# Altium schematic sheet Cart.SchDoc: Cart
size Tabloid; ApprovedBy: NA; CompanyName: Cospan Design LLC; DrawnBy: David McCoy; Engineer: David McCoy; DocumentNumber: 12; Revision: A; SheetNumber: 12; SheetTotal: 18; Client: OSH; Project: Guppy Buddy; ProjectPrettyName: Guppy Buddy
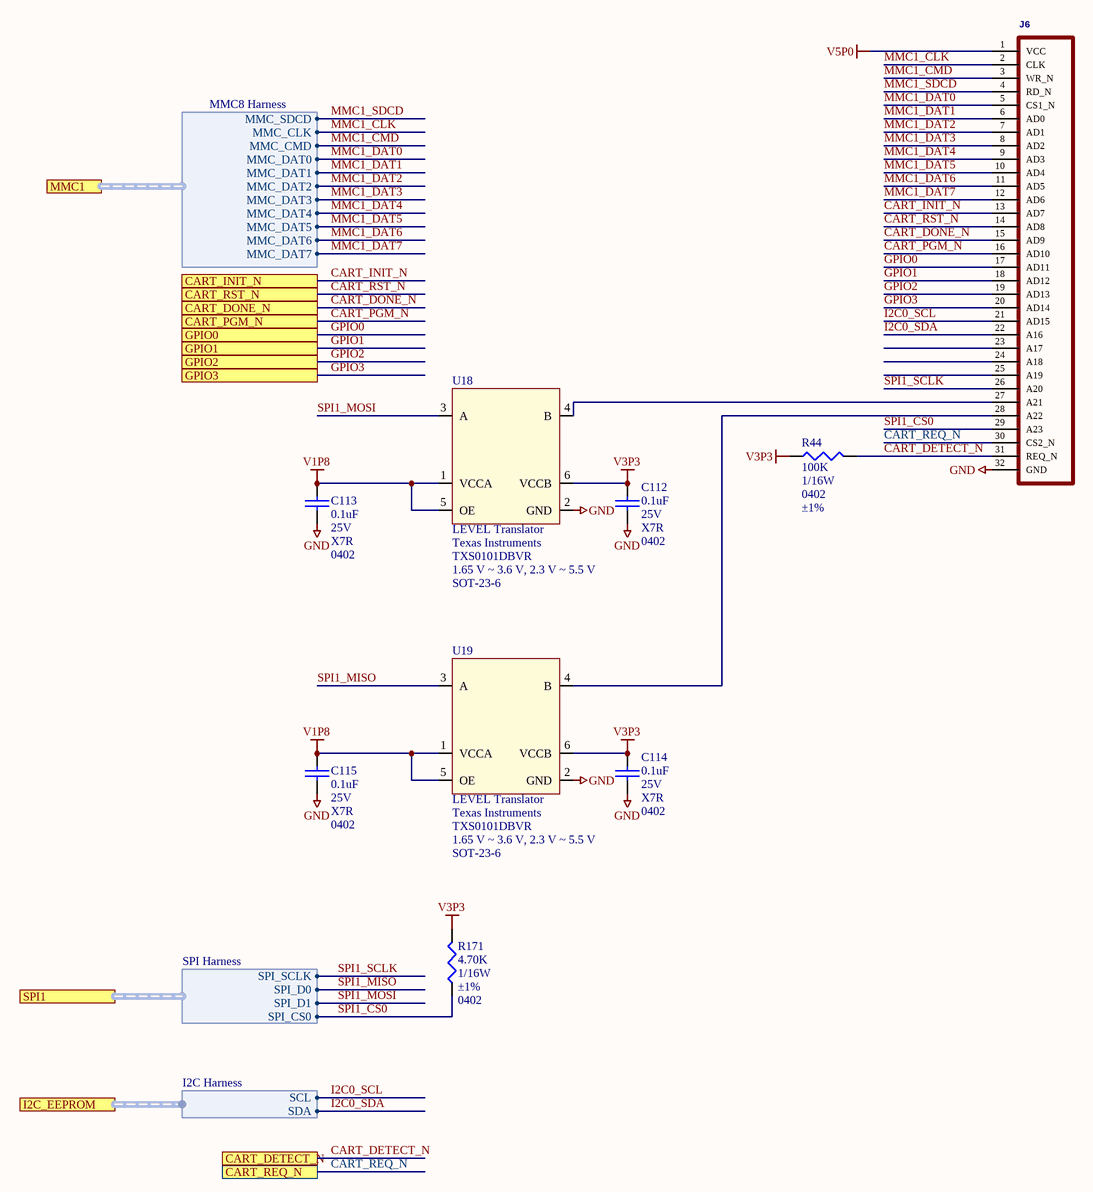
[diagram p0: Cart.SchDoc]

## Parts
C112  Capacitance: 0.1uF  Voltage - Rated: 25V  Temperature Coefficient: X7R  Package / Case: 0402  [C_0402]  (hidden comment: C_0402_0.1UF_25V)
C113  Capacitance: 0.1uF  Voltage - Rated: 25V  Temperature Coefficient: X7R  Package / Case: 0402  [C_0402]  (hidden comment: C_0402_0.1UF_25V)
C114  Capacitance: 0.1uF  Voltage - Rated: 25V  Temperature Coefficient: X7R  Package / Case: 0402  [C_0402]  (hidden comment: C_0402_0.1UF_25V)
C115  Capacitance: 0.1uF  Voltage - Rated: 25V  Temperature Coefficient: X7R  Package / Case: 0402  [C_0402]  (hidden comment: C_0402_0.1UF_25V)
J6  GB_CART1  [GB_CART]  (value not drawn)
R44  Resistance In Ohms: 100K  Power (Watts): 1/16W  Case: 0402  Tolerance: ±1%  [R_0402]  (hidden comment: R_0402_100K)
R171  Resistance In Ohms: 4.70K  Power (Watts): 1/16W  Tolerance: ±1%  Case: 0402  [R_0402]  (hidden comment: 4.7k Ohms)
U18  LEVEL Translator  Manufacturer: Texas Instruments  Manufacturer Part Number: TXS0101DBVR  Voltage - Supply: 1.65 V ~ 3.6 V, 2.3 V ~ 5.5 V  Package / Case: SOT-23-6  [TSOT-6]
U19  LEVEL Translator  Manufacturer: Texas Instruments  Manufacturer Part Number: TXS0101DBVR  Voltage - Supply: 1.65 V ~ 3.6 V, 2.3 V ~ 5.5 V  Package / Case: SOT-23-6  [TSOT-6]

## Ports
CART_DETECT_N, CART_DONE_N, CART_INIT_N, CART_PGM_N, CART_REQ_N, CART_RST_N, GPIO0, GPIO1, GPIO2, GPIO3, I2C_EEPROM (harness I2C Harness), MMC1 (harness MMC8 Harness), SPI1 (harness SPI Harness)

## Harnesses
SPI Harness: SPI_SCLK, SPI_D0, SPI_D1, SPI_CS0
MMC8 Harness: MMC_SDCD, MMC_CLK, MMC_CMD, MMC_DAT0, MMC_DAT1, MMC_DAT2, MMC_DAT3, MMC_DAT4, MMC_DAT5, MMC_DAT6, MMC_DAT7
I2C Harness: SCL, SDA

## Nets
GND: C112.1 C113.1 C114.1 C115.1 J6.32(GND) U18.2(GND) U19.2(GND)
V1P8: C113.2 C115.2 U18.1(VCCA) U18.5(OE) U19.1(VCCA) U19.5(OE)
V3P3: C112.2 C114.2 R44.2 R171.1 U18.6(VCCB) U19.6(VCCB)
V5P0: J6.1(VCC)
CART_DETECT_N: J6.31(REQ_N) R44.1 ; port CART_DETECT_N
CART_DONE_N: J6.15(AD9) ; port CART_DONE_N
CART_INIT_N: J6.13(AD7) ; port CART_INIT_N
CART_PGM_N: J6.16(AD10) ; port CART_PGM_N
CART_REQ_N: J6.30(CS2_N) ; port CART_REQ_N
CART_RST_N: J6.14(AD8) ; port CART_RST_N
GPIO0: J6.17(AD11) ; port GPIO0
GPIO1: J6.18(AD12) ; port GPIO1
GPIO2: J6.19(AD13) ; port GPIO2
GPIO3: J6.20(AD14) ; port GPIO3
I2C0_SCL: J6.21(AD15) ; port I2C_EEPROM.SCL
I2C0_SDA: J6.22(A16) ; port I2C_EEPROM.SDA
MMC1_CLK: J6.2(CLK) ; port MMC1.MMC_CLK
MMC1_CMD: J6.3(WR_N) ; port MMC1.MMC_CMD
MMC1_DAT0: J6.5(CS1_N) ; port MMC1.MMC_DAT0
MMC1_DAT1: J6.6(AD0) ; port MMC1.MMC_DAT1
MMC1_DAT2: J6.7(AD1) ; port MMC1.MMC_DAT2
MMC1_DAT3: J6.8(AD2) ; port MMC1.MMC_DAT3
MMC1_DAT4: J6.9(AD3) ; port MMC1.MMC_DAT4
MMC1_DAT5: J6.10(AD4) ; port MMC1.MMC_DAT5
MMC1_DAT6: J6.11(AD5) ; port MMC1.MMC_DAT6
MMC1_DAT7: J6.12(AD6) ; port MMC1.MMC_DAT7
MMC1_SDCD: J6.4(RD_N) ; port MMC1.MMC_SDCD
SPI1_CS0: J6.29(A23) R171.2 ; port SPI1.SPI_CS0
SPI1_MISO: U19.3(A) ; port SPI1.SPI_D0
SPI1_MOSI: U18.3(A) ; port SPI1.SPI_D1
SPI1_SCLK: J6.26(A20) ; port SPI1.SPI_SCLK
NetJ6_27: J6.27(A21) U18.4(B)
NetJ6_28: J6.28(A22) U19.4(B)

Not connected (* = marked no-connect by the designer): J6 23(A17) 24(A18) 25(A19)

## Notes on the sheet
- Project:
- http://www.cospandesign.com
- Cospan Design
- Document:
- Engineer:
- Title:
- Client:
- Approved By:
- Revision:
- Date:
- Number:
- of

## Library data of the parts
C112-C115 = C_0402_0.1UF_25V: CAP CER 0.1UF 25V X6S 0402; Manufacturer 1: Yageo; Manufacturer Part Number 1: CC0402KRX7R8BB104; Description 1: Cap Ceramic 0.1uF 25V X7R 10% SMD 0402 125C Paper T/R; Tolerance: 10%; Dissipation Factor: 3.5%; ComponentLink1URL: https://product.tdk.com/info/en/catalog/datasheets/mlcc_commercial_general_en.pdf; ComponentLink1Description: https://product.tdk.com/info/en/catalog/datasheets/mlcc_commercial_general_en.pdf; Supplier 1: Digi-Key; Supplier Part Number 1: 311-2077-1-ND; Stock 1: 0; Pricing 1: 1=0.1, 10=0.048, 100=0.0215, 500=0.01534, 1000=0.01205, 2500=0.01095, 5000=0.01007 (USD); Mount: Surface Mount; Case/Package: 0402; Case Code (Imperial): 0402; Case Code (Metric): 1005; Min Operating Temperature: -55°C; Max Operating Temperature: 125°C; Voltage Rating: 25V; Voltage Rating (DC): 25V; Packaging: Tape and Reel; Dielectric: X7R; Termination: SMD/SMT; Composition: Ceramic; Length: 1mm; Height: 0.5mm; Width: 0.02inch; Thickness: 0.022inch; Depth: 0.5mm; Radiation Hardening: No; Lead Free: Lead Free; Halogen Free: Halogen Free; ComponentLink2URL: https://datasheet.ciiva.com/11464/upy-gphc-x7r-6-3v-to-50v-8-11464889.pdf; ComponentLink2Description: https://datasheet.ciiva.com/11464/upy-gphc-x7r-6-3v-to-50v-8-11464889.pdf; ComponentLink3URL: https://datasheet.ciiva.com/13210/upy-gphc-x7r-6-3v-to-50v-8-12304-13210908.pdf; ComponentLink3Description: https://datasheet.ciiva.com/13210/upy-gphc-x7r-6-3v-to-50v-8-12304-13210908.pdf; ComponentLink4URL: https://datasheet.ciiva.com/17437/upy-gphc-x7r-6-3v-to-50v-8-17437357.pdf; ComponentLink4Description: https://datasheet.ciiva.com/17437/upy-gphc-x7r-6-3v-to-50v-8-17437357.pdf
J6 = J_GB_CART: Manufacturer 1: Amazon; DeviceName: 1; SymbolName_1: GB_CART; LibraryName: alex; DeviceSetName: GB_CART; Manufacturer Part Number 1: https://smile.amazon.com/Replacement-Cartridge-Card-Reader-Repair-Nintendo/dp/B077FV5W1L/ref=smi_ge_cnf_cnf_smi?_encoding=UTF8&adFormat=grid&adId=B077FV5W1L&adMode=auto&adType=smart&creativeASIN=B077FV5W1L&ie=UTF8&imprToken=YMtJVGSB8f0LFilQNy7ahg&impressionTimestamp=1529762984662&linkCode=w41&linkId=45a1439b5f48b7417e3978fa0774d918&pldnNewCustomer=1&ref-refURL=https%3A%2F%2Fhandheldlegend.com%2Fproducts%2Fgame-boy-cartridge-slot&slotNum=0&tag=hanhelleg-20
R44 = R_0402_100K: RES SMD 100K OHM 1% 1/16W 0402; Manufacturer: Yageo; Manufacturer Part Number: RC0402FR-07100KL; Temperature Coefficient: ±100ppm/°C; Supplier 1: Digi-Key; RoHS: RoHS Compliant; Category: Resistors; Stock 1: 4989982; Pricing 1: 1=0.1, 10=0.013, 25=0.0096, 100=0.0054, 250=0.00412, 500=0.00328, 1000=0.00242, 2500=0.0021, 5000=0.00173 (USD); Packaging: Cut Tape (CT); Resistance (Ohms): 100k; Composition: Thick Film; Features: Moisture Resistant; Operating Temperature: -55°C ~ 155°C; Package / Case: 0402 (1005 Metric); Supplier Device Package: 0402; Size / Dimension: 0.039" L x 0.020" W (1.00mm x 0.50mm); Height: 0.016" (0.40mm); Number of Terminations: 2; ComponentLink1URL: http://www.yageo.com/NewPortal/yageodocoutput?fileName=/pdf/R-Chip/PYu-RC_Group_51_RoHS_L_3.pdf; ComponentLink1Description: http://www.yageo.com/NewPortal/yageodocoutput?fileName=/pdf/R-Chip/PYu-RC_Group_51_RoHS_L_3.pdf; Supplier Part Number 1: 311-100KLRCT-ND
R171 = R_0402_4.70K: RES 4.70K OHM 1/16W 1% 0402 SMD; Manufacturer: Yageo; Manufacturer Part Number: RC0402FR-074K7L; Temperature Coefficient: ±100ppm/°C; Supplier 1: Digi-Key; Supplier Part Number 1: 311-4.7KLRCT-ND; RoHS: RoHS Compliant; Category: Resistors; Stock 1: 3610; Pricing: 10=0.014, 100=0.0063, 500=0.00382, 1000=0.0027, 5000=0.00203 (USD); Resistance (Ohms): 4.7K; Composition: Thick Film; Features: -; Package / Case: 0402 (1005 Metric); Size / Dimension: 0.039" L x 0.020" W (1.00mm x 0.50mm); Height: 0.016" (0.40mm); Number of Terminations: 2; Packaging: Cut Tape (CT); ComponentLink1URL: http://www.yageo.com/documents/recent/PYu-RC0402_51_RoHS_L_6.pdf; ComponentLink1Description: http://www.yageo.com/documents/recent/PYu-RC0402_51_RoHS_L_6.pdf
U18 U19 = U_TXS0101DBVR: IC V-LEVEL TRANSL BI-DIR SOT23-6; Logic Function: Translator, Bidirectional, Open Drain; Number of Bits: 1; Input Type: Voltage; Data Rate: 24Mbps; Differential - Input:Output: No/No; Propagation Delay (Max): 4.6ns; Supplier 1: Digi-Key; RoHS: RoHS Compliant; Category: Integrated Circuits (ICs); Stock 1: 19555; Pricing 1: 1=0.82, 10=0.722, 25=0.638, 100=0.556, 250=0.484, 500=0.412, 1000=0.33 (USD); Packaging: Cut Tape (CT); Output Type: Voltage; Number of Channels: 1; Number of Outputs/Channel: 1; Operating Temperature: -40°C ~ 85°C; Supplier Device Package: SOT-23-6; ComponentLink1URL: http://www.ti.com/lit/ds/symlink/txs0101.pdf; ComponentLink1Description: http://www.ti.com/lit/ds/symlink/txs0101.pdf; Supplier Part Number 1: 296-22863-1-ND